# Altium project PCB_15122020_01BC.PrjPcb (part 9 of 9)
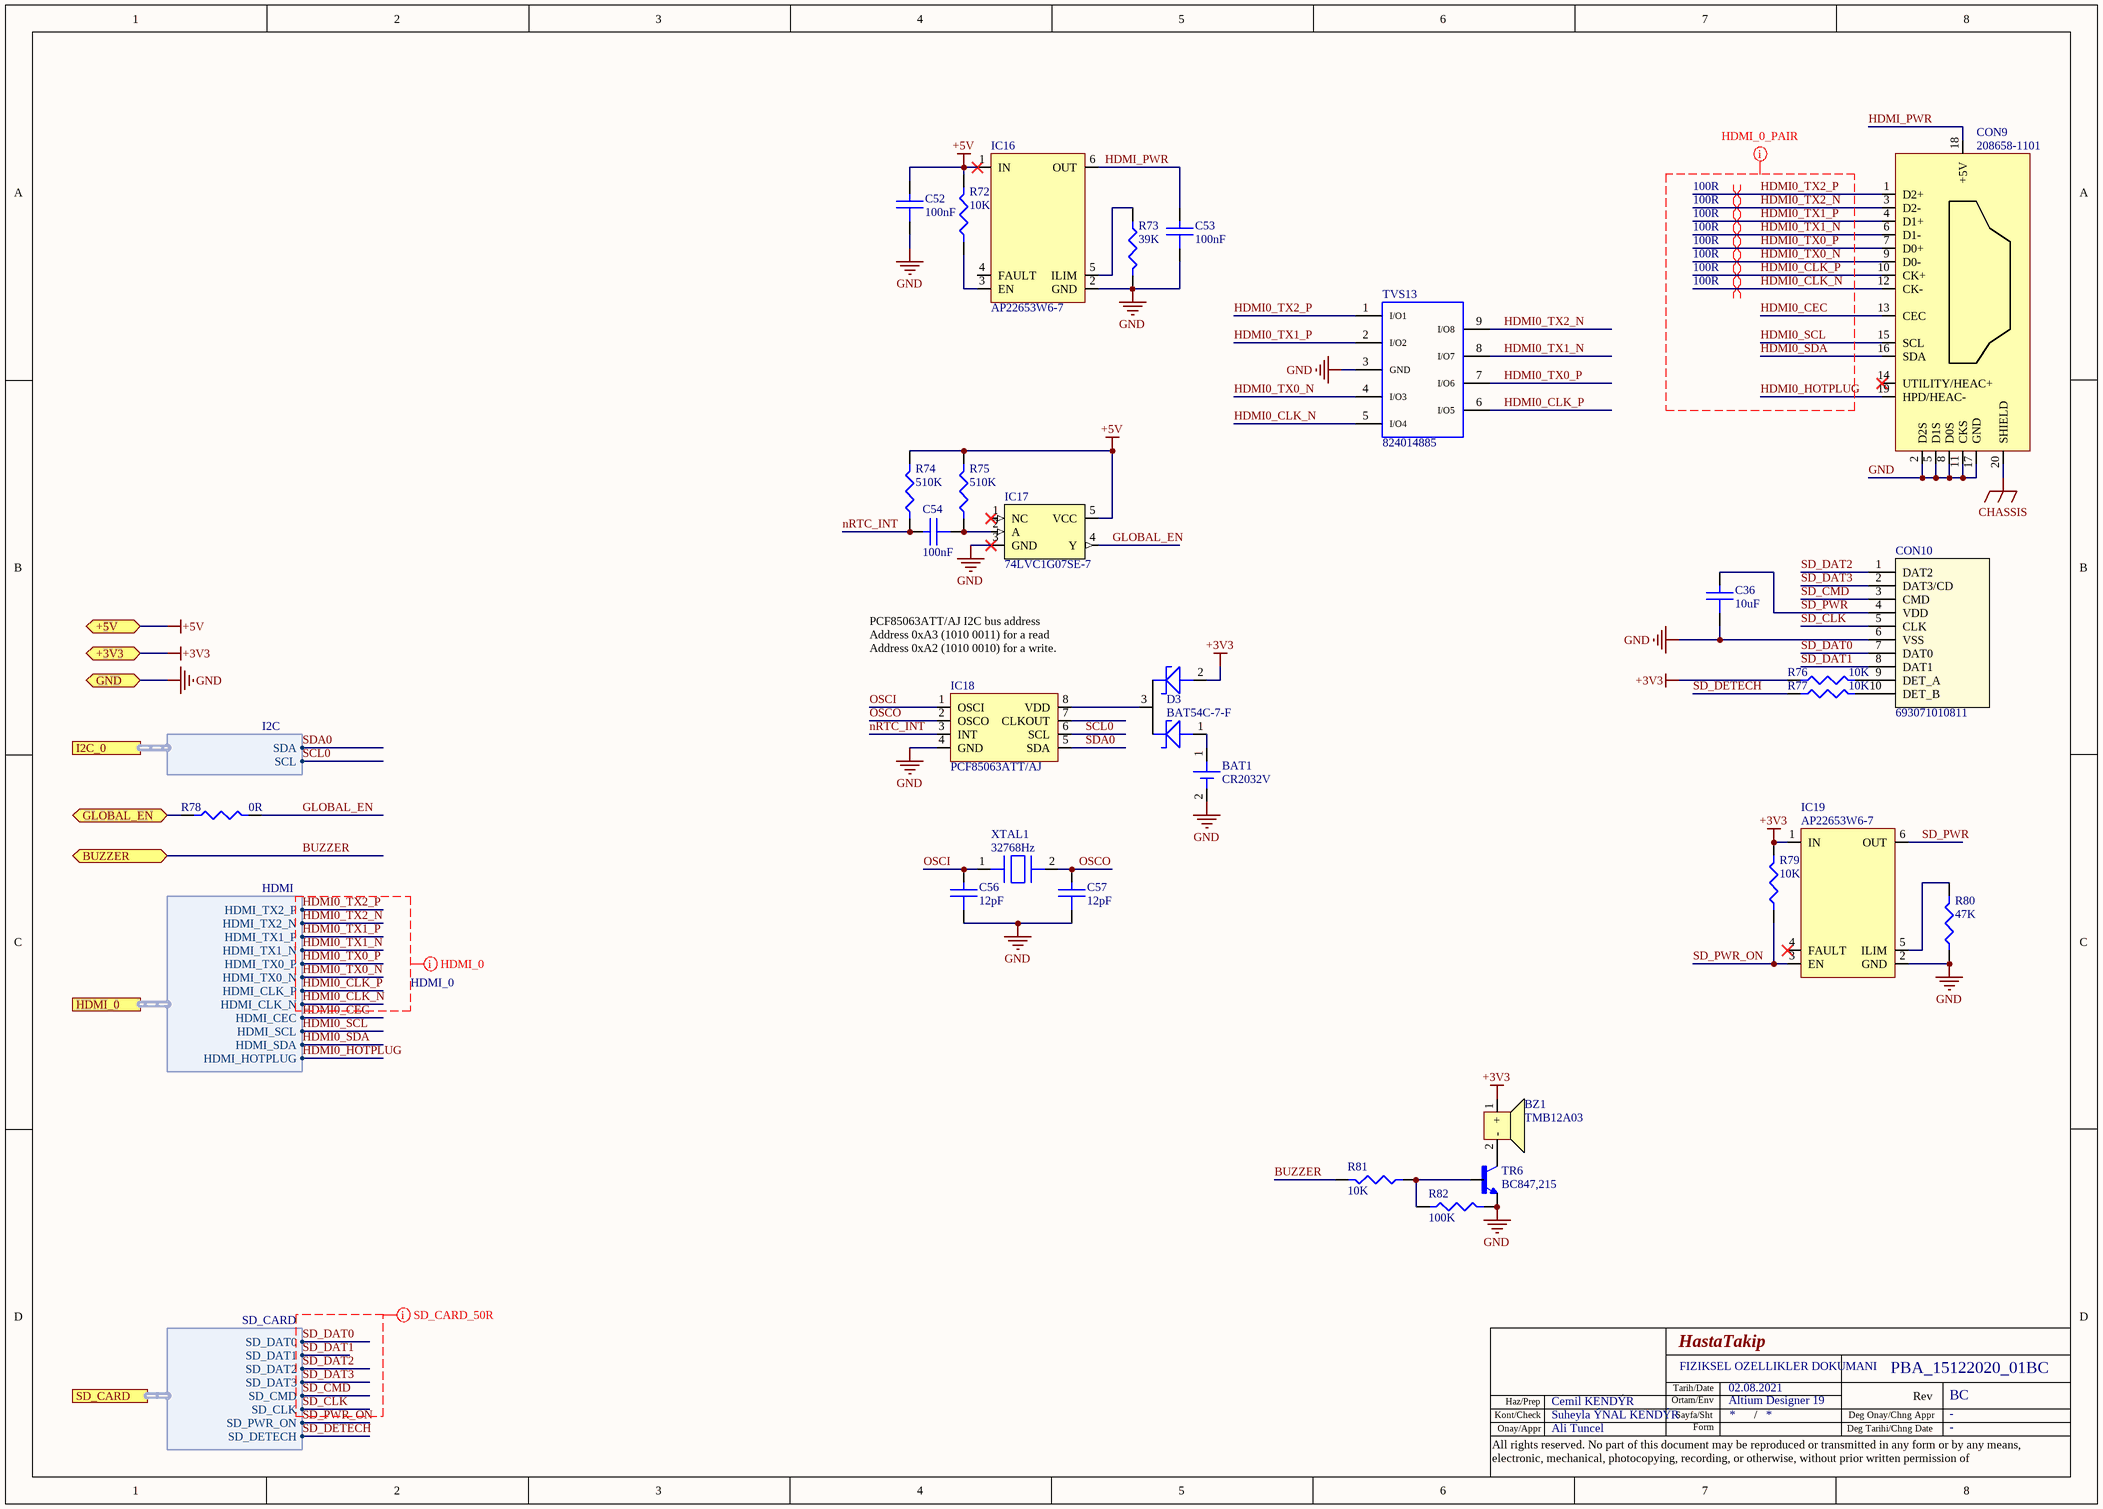
[diagram p9: RTC_SD_HDMI.SchDoc]

## Assembly variants
AA: not fitted C2 C3 C4 C36 C51_RS232_1 C51_RS232_2 C51_RS232_3 C51_RS232_4 C51_RS232_5 C51_RS232_6 C51_RS232_7 C51_RS232_8 C58 C60 C61 C62 C63 C73 CON1 CON7_RS232_1 CON7_RS232_2 CON7_RS232_3 CON7_RS232_4 CON7_RS232_5 CON7_RS232_6 CON7_RS232_7 CON7_RS232_8 CON8 CON10 F1 F2 F3 F4 F5 FR3 FR4 FR9_RS232_1 FR9_RS232_2 FR9_RS232_3 FR9_RS232_4 FR9_RS232_5 FR9_RS232_6 FR9_RS232_7 FR9_RS232_8 FR10_RS232_1 FR10_RS232_2 FR10_RS232_3 FR10_RS232_4 FR10_RS232_5 FR10_RS232_6 FR10_RS232_7 FR10_RS232_8 H2 H4 H5 IC2 IC4 IC5 IC6 IC9 IC15_RS232_1 IC15_RS232_2 IC15_RS232_3 IC15_RS232_4 IC15_RS232_5 IC15_RS232_6 IC15_RS232_7 IC15_RS232_8 IC19 J13 LOGO1 LOGO2 LOGO3 LOGO4 LOGO 5 R3 R4 R5 R6 R7 R8 R9 R10 R40 R41 R56_RS232_1 R56_RS232_2 R56_RS232_3 R56_RS232_4 R56_RS232_5 R56_RS232_6 R56_RS232_7 R56_RS232_8 R57_RS232_1 R57_RS232_2 R57_RS232_3 R57_RS232_4 R57_RS232_5 R57_RS232_6 R57_RS232_7 R57_RS232_8 R61_RS232_1 R61_RS232_2 R61_RS232_3 R61_RS232_4 R61_RS232_5 R61_RS232_6 R61_RS232_7 R61_RS232_8 R65_RS232_1 R65_RS232_2 R65_RS232_3 R65_RS232_4 R65_RS232_5 R65_RS232_6 R65_RS232_7 R65_RS232_8 R66_RS232_1 R66_RS232_2 R66_RS232_3 R66_RS232_4 R66_RS232_5 R66_RS232_6 R66_RS232_7 R66_RS232_8 R67_RS232_1 R67_RS232_2 R67_RS232_3 R67_RS232_4 R67_RS232_5 R67_RS232_6 R67_RS232_7 R67_RS232_8 R70_RS232_1 R70_RS232_2 R70_RS232_3 R70_RS232_4 R70_RS232_5 R70_RS232_6 R70_RS232_7 R70_RS232_8 R76 R77 R78 R79 R80 R83 R84 R85 R95 TP3 TP4 TP5 TVS9_RS232_1 TVS9_RS232_2 TVS9_RS232_3 TVS9_RS232_4 TVS9_RS232_5 TVS9_RS232_6 TVS9_RS232_7 TVS9_RS232_8
CA: not fitted C45_RS232_1 C45_RS232_2 C45_RS232_3 C46_RS232_1 C46_RS232_2 C46_RS232_3 C47_RS232_1 C47_RS232_2 C47_RS232_3 C48_RS232_1 C48_RS232_2 C48_RS232_3 C49_RS232_1 C49_RS232_2 C49_RS232_3 C51_RS232_4 C104 C105 C106 C107 C108 C109 C110 C111 C112 C113 C114 C115 C116 C117 C118 CM4 CON7_RS232_4 CON14 CON15 CON16 CON17 CON18 CON19 CON20 CON21 F1 F2 F3 F4 F5 FR9_RS232_4 FR10_RS232_4 FR19 FR20 H2 H4 H5 IC14_RS232_1 IC14_RS232_2 IC14_RS232_3 IC15_RS232_4 IC27 IC28 J13 J14 J15 LOGO1 LOGO2 LOGO3 LOGO4 LOGO 5 Mech5 Mech6 Mech7 Mech8 Mech9 Mech10 Mech11 Mech12 R61_RS232_4 R65_RS232_4 R66_RS232_4 R67_RS232_4 R70_RS232_4 R116 R117 R118 R119 R120 R121 R122 TVS1_RS232_1 TVS1_RS232_2 TVS1_RS232_3 TVS2_RS232_1 TVS2_RS232_2 TVS2_RS232_3 TVS3_RS232_1 TVS3_RS232_2 TVS3_RS232_3 TVS4_RS232_1 TVS4_RS232_2 TVS4_RS232_3 TVS9_RS232_4 XTAL4
BA: not fitted C2 C3 C4 C36 C38_RS232_5 C38_RS232_6 C38_RS232_7 C38_RS232_8 C39_RS232_5 C39_RS232_6 C39_RS232_7 C39_RS232_8 C45_RS232_5 C45_RS232_6 C45_RS232_7 C45_RS232_8 C46_RS232_5 C46_RS232_6 C46_RS232_7 C46_RS232_8 C47_RS232_5 C47_RS232_6 C47_RS232_7 C47_RS232_8 C48_RS232_5 C48_RS232_6 C48_RS232_7 C48_RS232_8 C49_RS232_5 C49_RS232_6 C49_RS232_7 C49_RS232_8 C51_RS232_1 C51_RS232_2 C51_RS232_3 C51_RS232_4 C51_RS232_5 C51_RS232_6 C51_RS232_7 C51_RS232_8 C55_RS232_5 C55_RS232_6 C55_RS232_7 C55_RS232_8 C58 C60 C61 C62 C63 C73 C104 C105 C106 C107 C108 C109 C110 C111 C112 C113 C114 C115 C116 C117 C118 C119_RS232_5 C119_RS232_6 C119_RS232_7 C119_RS232_8 C120_RS232_5 C120_RS232_6 C120_RS232_7 C120_RS232_8 C121_RS232_5 C121_RS232_6 C121_RS232_7 C121_RS232_8 CM4 CON1 CON7_RS232_1 CON7_RS232_2 CON7_RS232_3 CON7_RS232_4 CON7_RS232_5 CON7_RS232_6 CON7_RS232_7 CON7_RS232_8 CON8 CON10 CON18 CON19 CON20 CON21 F1 F2 F3 F4 F5 FR3 FR4 FR9_RS232_1 FR9_RS232_2 FR9_RS232_3 FR9_RS232_4 FR9_RS232_5 FR9_RS232_6 FR9_RS232_7 FR9_RS232_8 FR10_RS232_1 FR10_RS232_2 FR10_RS232_3 FR10_RS232_4 FR10_RS232_5 FR10_RS232_6 FR10_RS232_7 FR10_RS232_8 FR19 FR20 H2 H4 H5 IC2 IC4 IC5 IC6 IC9 IC14_RS232_5 IC14_RS232_6 IC14_RS232_7 IC14_RS232_8 IC15_RS232_1 IC15_RS232_2 IC15_RS232_3 IC15_RS232_4 IC15_RS232_5 IC15_RS232_6 IC15_RS232_7 IC15_RS232_8 IC19 IC27 IC28 IC29_RS232_5 IC29_RS232_6 IC29_RS232_7 IC29_RS232_8 IC30_RS232_5 IC30_RS232_6 IC30_RS232_7 IC30_RS232_8 IC31_RS232_5 IC31_RS232_6 IC31_RS232_7 IC31_RS232_8 IC32_RS232_5 IC32_RS232_6 IC32_RS232_7 IC32_RS232_8 IC33_RS232_5 IC33_RS232_6 IC33_RS232_7 IC33_RS232_8 J12_RS232_5 J12_RS232_6 J12_RS232_7 J12_RS232_8 J13 LED3_RS232_5 LED3_RS232_6 LED3_RS232_7 LED3_RS232_8 LOGO1 LOGO2 LOGO3 LOGO4 LOGO 5 Mech5 Mech6 Mech7 Mech8 R3 R4 R5 R6 R7 R8 R9 R10 R40 R41 R55_RS232_5 R55_RS232_6 R55_RS232_7 R55_RS232_8 R56_RS232_1 R56_RS232_2 R56_RS232_3 R56_RS232_4 R56_RS232_5 R56_RS232_6 R56_RS232_7 R56_RS232_8 R57_RS232_1 R57_RS232_2 R57_RS232_3 R57_RS232_4 R57_RS232_5 R57_RS232_6 R57_RS232_7 R57_RS232_8 R61_RS232_1 R61_RS232_2 R61_RS232_3 R61_RS232_4 R61_RS232_5 R61_RS232_6 R61_RS232_7 R61_RS232_8 R62_RS232_5 R62_RS232_6 R62_RS232_7 R62_RS232_8 R65_RS232_1 R65_RS232_2 R65_RS232_3 R65_RS232_4 R65_RS232_5 R65_RS232_6 R65_RS232_7 R65_RS232_8 R66_RS232_1 R66_RS232_2 R66_RS232_3 R66_RS232_4 R66_RS232_5 R66_RS232_6 R66_RS232_7 R66_RS232_8 R67_RS232_1 R67_RS232_2 R67_RS232_3 R67_RS232_4 R67_RS232_5 R67_RS232_6 R67_RS232_7 R67_RS232_8 R69_RS232_5 R69_RS232_6 R69_RS232_7 R69_RS232_8 R70_RS232_1 R70_RS232_2 R70_RS232_3 R70_RS232_4 R70_RS232_5 R70_RS232_6 R70_RS232_7 R70_RS232_8 R71_RS232_5 R71_RS232_6 R71_RS232_7 R71_RS232_8 R76 R77 R78 R79 R80 R83 R84 R85 R90_RS232_5 R90_RS232_6 R90_RS232_7 R90_RS232_8 R95 R97_RS232_5 R97_RS232_6 R97_RS232_7 R97_RS232_8 R116 R117 R118 R119 R120 R121 R122 TP3 TP4 TP5 TVS1_RS232_5 TVS1_RS232_6 TVS1_RS232_7 TVS1_RS232_8 TVS2_RS232_5 TVS2_RS232_6 TVS2_RS232_7 TVS2_RS232_8 TVS3_RS232_5 TVS3_RS232_6 TVS3_RS232_7 TVS3_RS232_8 TVS4_RS232_5 TVS4_RS232_6 TVS4_RS232_7 TVS4_RS232_8 TVS9_RS232_1 TVS9_RS232_2 TVS9_RS232_3 TVS9_RS232_4 TVS9_RS232_5 TVS9_RS232_6 TVS9_RS232_7 TVS9_RS232_8 XTAL4